# EAGLE schematic PM_proto_3 (EAGLE 9.0.0)
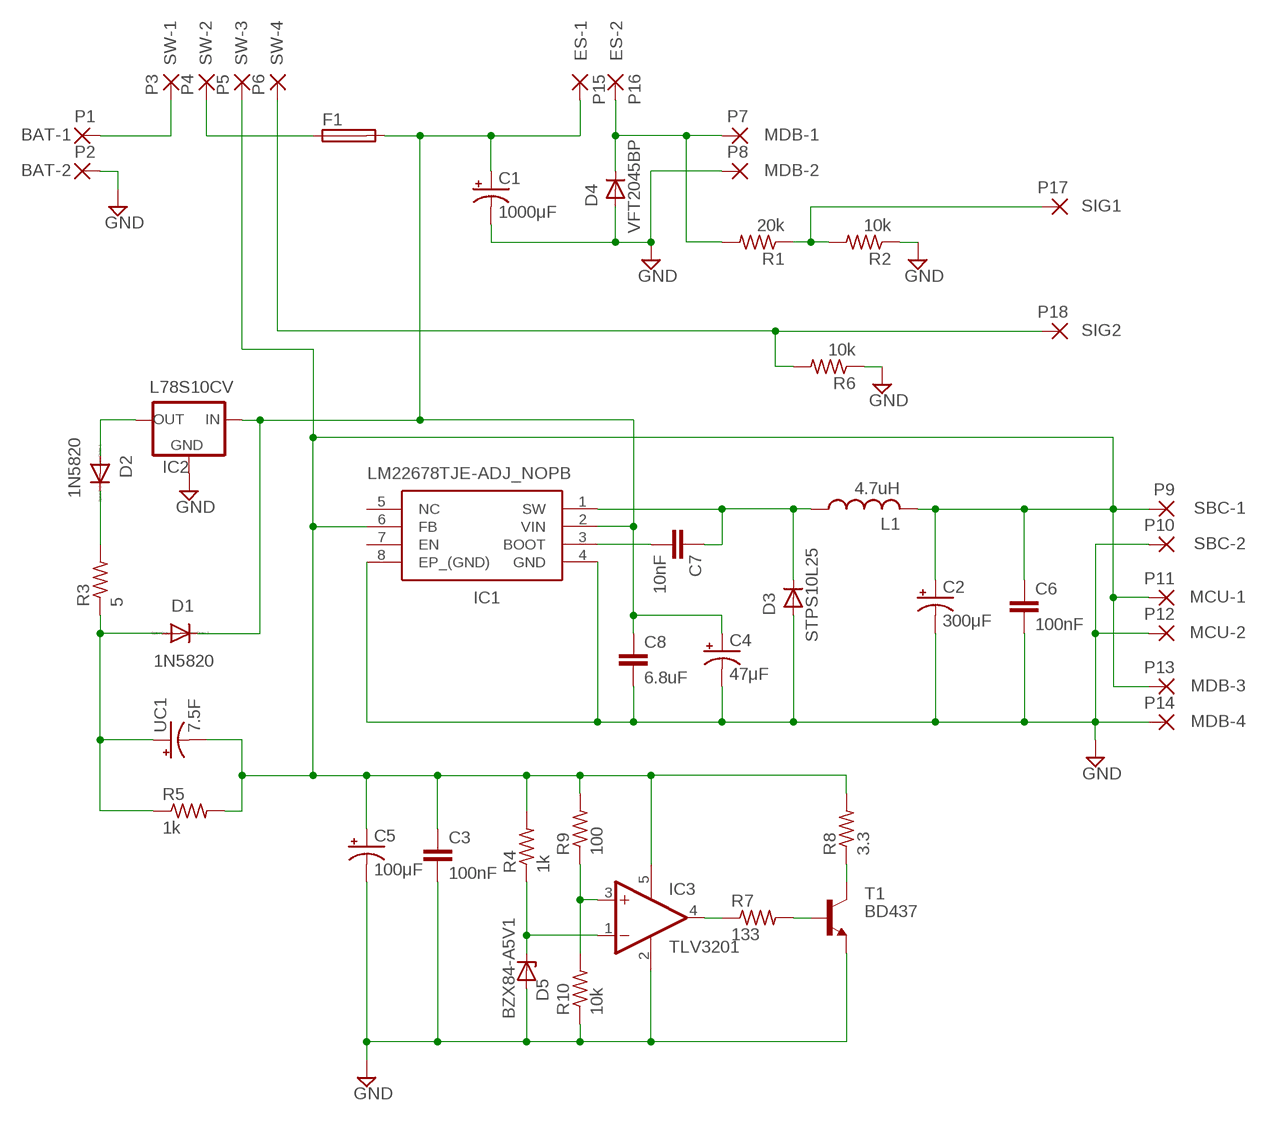
[diagram p0: schematic, sheet 1]

## Parts
C1  1000μF  CPOL-USE7.5-16  [E7,5-16]
C2  300μF  CPOL-USE2,5-6E  [E2,5-6E]
C3  100nF  C-EU025-024X044  [C025-024X044]
C4  47μF  CPOL-USE2,5-6E  [E2,5-6E]
C5  100μF  CPOL-USE2,5-6E  [E2,5-6E]
C6  100nF  C-EU025-024X044  [C025-024X044]
C7  10nF  C-EU025-024X044  [C025-024X044]
C8  6.8uF  C-EU025-024X044  [C025-024X044]
D1  1N5820  1N4004  [DO41-10]
D2  1N5820  1N4004  [DO41-10]
D3  STPS10L25  VFT2045BP  [VFT2045BP]
D4  VFT2045BP  [VFT2045BP]
D5  BZX84-A5V1  1N4728  [DO41Z10]
F1  0297015FUSE  [0297015HOLDER]
IC1  LM22678TJE-ADJ_NOPB  [LM22678TJEADJNOPB]
IC2  L78S10CV  78XXS  [78XXS]
IC3  TLV3201  TL331  [DBV-R-PDSO-G5]
L1  4.7uH  L-US6000-XXX-RC  [6000-XXXX-RC]
P1  BAT-1  1,6/0,8  [1,6/0,8]
P2  BAT-2  1,6/0,8  [1,6/0,8]
P3  SW-1  1,6/0,8  [1,6/0,8]
P4  SW-2  1,6/0,8  [1,6/0,8]
P5  SW-3  1,6/0,8  [1,6/0,8]
P6  SW-4  1,6/0,8  [1,6/0,8]
P7  MDB-1  1,6/0,8  [1,6/0,8]
P8  MDB-2  1,6/0,8  [1,6/0,8]
P9  SBC-1  1,6/0,8  [1,6/0,8]
P10  SBC-2  1,6/0,8  [1,6/0,8]
P11  MCU-1  1,6/0,8  [1,6/0,8]
P12  MCU-2  1,6/0,8  [1,6/0,8]
P13  MDB-3  1,6/0,8  [1,6/0,8]
P14  MDB-4  1,6/0,8  [1,6/0,8]
P15  ES-1  1,6/0,8  [1,6/0,8]
P16  ES-2  1,6/0,8  [1,6/0,8]
P17  SIG1  1,6/0,8  [1,6/0,8]
P18  SIG2  1,6/0,8  [1,6/0,8]
R1  20k  R-US_0204/7  [0204/7]
R2  10k  R-US_0204/7  [0204/7]
R3  5  TNP10SC10R0FE  [TNP10SC10R0FE]
R4  1k  R-US_0204/7  [0204/7]
R5  1k  R-US_0204/7  [0204/7]
R6  10k  R-US_0204/7  [0204/7]
R7  133  R-US_0204/7  [0204/7]
R8  3.3  R-US_0204/7  [0204/7]
R9  100  R-US_0204/7  [0204/7]
R10  10k  R-US_0204/7  [0204/7]
T1  BD437  2N706  [TO18]
UC1  7.5F  SCMT32D755MRBB0  [SCMT32D755MRBB0]

## Nets
BATT_1: P1.1(P) P3.1(P)
BATT_2: F1.1 F1.2 P4.1(P)
BATT_3: C1.+ C4.+ C8.1 D1.C F1.3 F1.4 IC1.2(VIN) IC2.IN P15.1(P)
BATT_4: D4.1(C) P7.1(P) P16.1(P) R1.2
CAP_POS: D1.A R3.1 R5.1 UC1.1(+)
GND: C1.- C2.- C3.2 C4.- C5.- C6.2 C8.2 D3.2(A) D4.2(A) D5.A IC1.4(GND) IC1.8(EP_(GND)) IC2.GND IC3.2(GND) P2.1(P) P8.1(P) P10.1(P) P12.1(P) P14.1(P) R2.1 R6.1 R10.1 T1.1(E)
N$1: C7.2 IC1.3(BOOT)
N$2: D2.A IC2.OUT
N$3: D2.C R3.2
N$4: C7.1 D3.1(C) IC1.1(SW) L1.1
N$5: D5.C IC3.1(-IN) R4.1
N$6: IC3.4(OUT) R7.1
N$7: R7.2 T1.2(B)
N$8: P6.1(P) P18.1(P) R6.2
N$9: R8.1 T1.3(C)
N$10: IC3.3(+IN) R9.1 R10.2
ON_SENSE: C2.+ C3.1 C5.+ C6.1 IC1.6(FB) IC3.5(V+) L1.2 P5.1(P) P9.1(P) P11.1(P) P13.1(P) R4.2 R5.2 R8.2 R9.2 UC1.2(-)
V_SENSE: P17.1(P) R1.1 R2.2
Unconnected: IC1.5(NC) IC1.7(EN)

## Library data of the parts
C1 C2 C4 C5 = rcl:CPOL-US: POLARIZED CAPACITOR, American symbol; SPICEPREFIX: C
C3 C6-C8 = rcl:C-EU: CAPACITOR, European symbol; SPICEPREFIX: C
D1 D2 = diode:1N4004: DIODE general purpose rectifier, 1 A
D3 D4 = rasm_parts:VFT2045BP: Trench MOS Barrier Schottky Rectifier. 20A 0.51V.
D5 = diode:1N4728: Z DIODE 3.3 V, 1W, 5 percent
F1 = rasm_parts:0297015FUSE: MINI Blade Fuse 0297xxx
IC1 = rasm-other:LM22678TJE-ADJ_NOPB: 5A SIMPLE SWITCHER, Step-Down Voltage Regulator with Precision Enable Source: Datasheet <http://www.ti.com/lit/ds/symlink/lm22678.pdf>; ARROW_PART_NUMBER: LM22678TJE-ADJ/NOPB; ARROW_PRICE/STOCK: https://www.arrow.com/en/products/lm22678tje-adjnopb/texas-instruments; DESCRIPTION: 5A SIMPLE SWITCHER, Step-Down Voltage Regulator with Precision Enable; HEIGHT: 2mm; MANUFACTURER_NAME: Texas Instruments; MANUFACTURER_PART_NUMBER: LM22678TJE-ADJ/NOPB; RS_PART_NUMBER: 1625056; RS_PRICE/STOCK: http://uk.rs-online.com/web/p/products/1625056
IC2 = v-reg:78XXS: VOLTAGE REGULATOR
IC3 = linear:TL331: SINGLE DIFFERENTIAL COMPARATOR Source: Data sheet <http://www.ti.com/lit/ds/symlink/tl331-q1.pdf>
L1 = rcl:L-US: INDUCTOR, American symbol; SPICEPREFIX: L
P1-P18 = wirepad:1,6/0,8: THROUGH-HOLE PAD
R1 R2 R4-R10 = rcl:R-US_: RESISTOR, American symbol; SPICEPREFIX: R
R3 = rasm_parts:TNP10SC10R0FE
T1 = transistor:2N706: NPN TRANSISTOR
UC1 = rasm_parts:SCMT32D755MRBB0: 5.4V 7.5F supercapacitor/ultracapacitor.